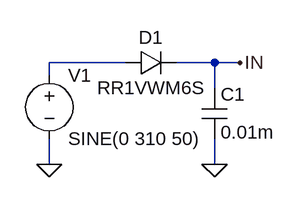
[diagram p0: schematic half_wave.asc]
half_wave.asc, the LTspice schematic file:
Version 4
SHEET 1 880 680
WIRE 48 -640 -48 -640
WIRE 160 -640 112 -640
WIRE 192 -640 160 -640
WIRE -48 -624 -48 -640
WIRE 160 -608 160 -640
WIRE -48 -512 -48 -544
WIRE 160 -512 160 -544
FLAG -48 -512 0
FLAG 160 -512 0
FLAG 192 -640 IN
SYMBOL diode 48 -624 R270
WINDOW 0 32 32 VTop 2
WINDOW 3 0 32 VBottom 2
SYMATTR InstName D1
SYMATTR Value RR1VWM6S
SYMBOL voltage -48 -640 R0
WINDOW 123 0 0 Left 0
WINDOW 39 0 0 Left 0
SYMATTR InstName V1
SYMATTR Value SINE(0 310 50)
SYMBOL cap 144 -608 R0
SYMATTR InstName C1
SYMATTR Value 0.01m

The netlist it stands for:
* half_wave.asc
D1 N001 IN RR1VWM6S
V1 N001 0 SINE(0 310 50)
C1 IN 0 0.01m
.model D D
.lib standard.dio
.backanno
.end